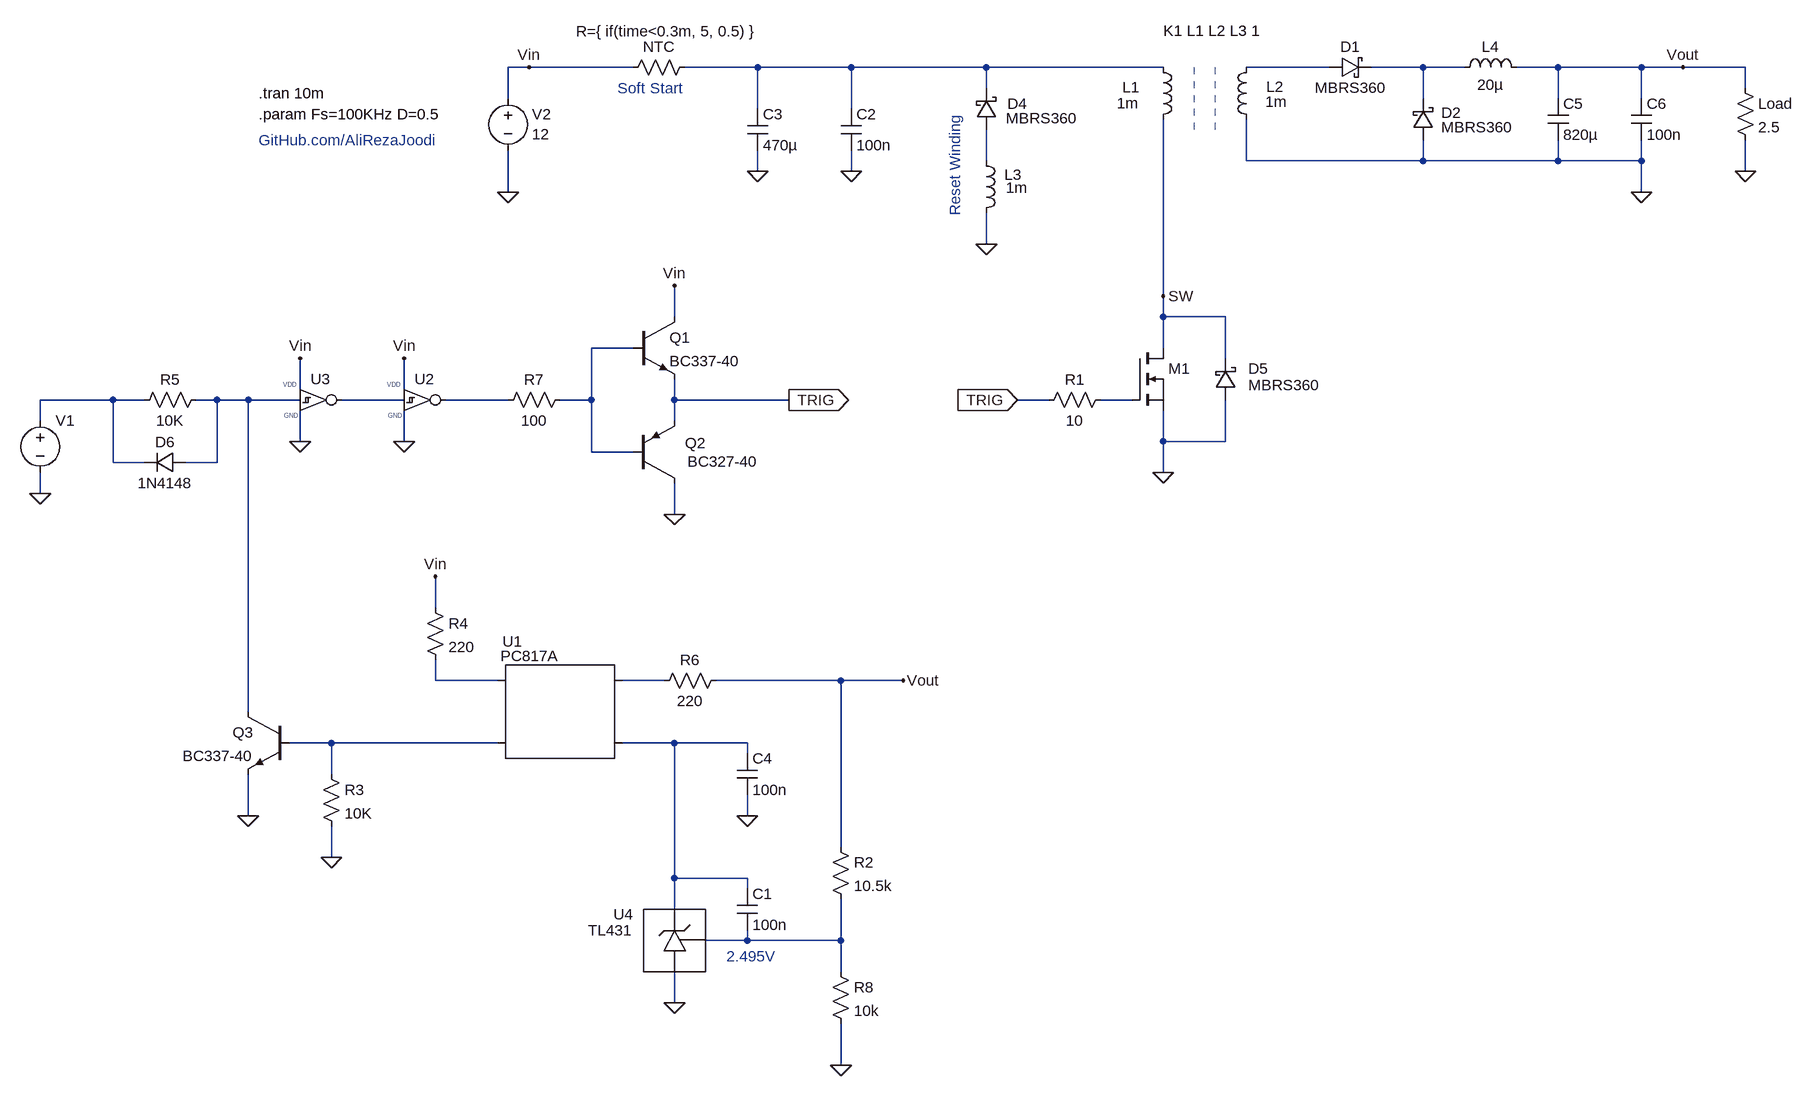
[diagram p0: schematic v2.0.asc]
v2.0.asc, the LTspice schematic file:
Version 4.1
SHEET 1 2268 1748
WIRE -144 96 -176 96
WIRE 16 96 -144 96
WIRE 208 96 96 96
WIRE 352 96 208 96
WIRE 560 96 352 96
WIRE 832 96 560 96
WIRE 1088 96 960 96
WIRE 1232 96 1152 96
WIRE 1296 96 1232 96
WIRE 1440 96 1376 96
WIRE 1568 96 1440 96
WIRE 1632 96 1568 96
WIRE 1728 96 1632 96
WIRE 560 128 560 96
WIRE 1728 128 1728 96
WIRE -176 144 -176 96
WIRE 1232 144 1232 96
WIRE 1440 144 1440 96
WIRE 1568 144 1568 96
WIRE 208 160 208 96
WIRE 352 160 352 96
WIRE 560 240 560 192
WIRE 960 240 960 176
WIRE 1232 240 1232 208
WIRE 1232 240 960 240
WIRE 1440 240 1440 208
WIRE 1440 240 1232 240
WIRE 1568 240 1568 208
WIRE 1568 240 1440 240
WIRE 208 256 208 224
WIRE 352 256 352 224
WIRE 1728 256 1728 208
WIRE -176 288 -176 224
WIRE 1568 288 1568 240
WIRE 560 368 560 320
WIRE 832 448 832 176
WIRE 80 480 80 432
WIRE 832 480 832 448
WIRE 928 480 832 480
WIRE 16 528 -48 528
WIRE 832 528 832 480
WIRE 928 544 928 480
WIRE -496 592 -496 544
WIRE -336 592 -336 544
WIRE -784 608 -896 608
WIRE -736 608 -784 608
WIRE -624 608 -656 608
WIRE -576 608 -624 608
WIRE -496 608 -576 608
WIRE -336 608 -432 608
WIRE -176 608 -272 608
WIRE -48 608 -48 528
WIRE -48 608 -96 608
WIRE 80 608 80 576
WIRE 256 608 80 608
WIRE 656 608 608 608
WIRE 784 608 736 608
WIRE -896 640 -896 608
WIRE 80 640 80 608
WIRE -496 672 -496 624
WIRE -336 672 -336 624
WIRE 832 672 832 624
WIRE 928 672 928 608
WIRE 928 672 832 672
WIRE -48 688 -48 608
WIRE 16 688 -48 688
WIRE -784 704 -784 608
WIRE -736 704 -784 704
WIRE -624 704 -624 608
WIRE -624 704 -672 704
WIRE 832 720 832 672
WIRE -896 752 -896 720
WIRE 80 784 80 736
WIRE -288 928 -288 880
WIRE -288 1040 -288 1008
WIRE -192 1040 -288 1040
WIRE 64 1040 0 1040
WIRE 336 1040 144 1040
WIRE 432 1040 336 1040
WIRE -576 1088 -576 608
WIRE -448 1136 -512 1136
WIRE -192 1136 -448 1136
WIRE 80 1136 0 1136
WIRE 192 1136 80 1136
WIRE 192 1152 192 1136
WIRE -448 1184 -448 1136
WIRE -576 1248 -576 1184
WIRE 192 1248 192 1216
WIRE 336 1296 336 1040
WIRE -448 1312 -448 1264
WIRE 80 1344 80 1136
WIRE 192 1344 80 1344
WIRE 192 1360 192 1344
WIRE 80 1392 80 1344
WIRE 192 1440 192 1424
WIRE 192 1440 128 1440
WIRE 336 1440 336 1376
WIRE 336 1440 192 1440
WIRE 336 1488 336 1440
WIRE 80 1536 80 1488
WIRE 336 1632 336 1568
FLAG -896 752 0
FLAG -176 288 0
FLAG 832 720 0
FLAG 352 256 0
FLAG 208 256 0
FLAG -144 96 Vin
FLAG 1568 288 0
FLAG 80 432 Vin
FLAG 80 784 0
FLAG 832 448 SW
FLAG 560 368 0
FLAG 1728 256 0
FLAG -576 1248 0
FLAG -448 1312 0
FLAG -288 880 Vin
FLAG -336 544 Vin
FLAG -336 672 0
FLAG -496 544 Vin
FLAG -496 672 0
FLAG 80 1536 0
FLAG 1632 96 Vout
FLAG 336 1632 0
FLAG 432 1040 Vout
FLAG 608 608 TRIG
IOPIN 608 608 In
FLAG 256 608 TRIG
IOPIN 256 608 Out
FLAG 192 1248 0
SYMBOL voltage -896 624 R0
WINDOW 3 24 96 Invisible 2
WINDOW 123 0 0 Left 0
WINDOW 39 39 69 Left 2
SYMATTR Value PULSE(0 12 0 {0.01/Fs} {0.01/Fs} {D/Fs} {1/Fs})
SYMATTR InstName V1
SYMBOL res 640 624 R270
WINDOW 0 32 56 VTop 2
WINDOW 3 0 56 VBottom 2
SYMATTR InstName R1
SYMATTR Value 10
SYMBOL ind 816 80 R0
WINDOW 0 -47 47 Left 2
WINDOW 3 -55 71 Left 2
SYMATTR InstName L1
SYMATTR Value 1m
SYMATTR Type ind
SYMBOL voltage -176 128 R0
WINDOW 0 37 40 Left 2
WINDOW 3 37 71 Left 2
WINDOW 123 0 0 Left 0
WINDOW 39 0 0 Left 0
SYMATTR InstName V2
SYMATTR Value 12
SYMBOL cap 336 160 R0
SYMATTR InstName C2
SYMATTR Value 100n
SYMBOL cap 192 160 R0
SYMATTR InstName C3
SYMATTR Value 470µ
SYMBOL ind 976 80 M0
WINDOW 0 -42 46 Left 2
WINDOW 3 -47 69 Left 2
SYMATTR InstName L2
SYMATTR Value 1m
SYMATTR Type ind
SYMBOL cap 1424 144 R0
SYMATTR InstName C5
SYMATTR Value 820µ
SYMBOL cap 1552 144 R0
SYMATTR InstName C6
SYMATTR Value 100n
SYMBOL res 1712 112 R0
SYMATTR InstName Load
SYMATTR Value 2.5
SYMBOL ind 1280 112 R270
WINDOW 0 32 56 VTop 2
WINDOW 3 5 56 VBottom 2
SYMATTR InstName L4
SYMATTR Value 20µ
SYMBOL nmos 784 528 R0
WINDOW 3 56 72 Invisible 2
SYMATTR Value BSC100N06LS3
SYMATTR InstName M1
SYMBOL npn 16 480 R0
SYMATTR InstName Q1
SYMATTR Value BC337-40
SYMBOL pnp 16 736 M180
WINDOW 0 80 62 Left 2
WINDOW 3 84 33 Left 2
SYMATTR InstName Q2
SYMATTR Value BC327-40
SYMBOL res -752 624 R270
WINDOW 0 32 56 VTop 2
WINDOW 3 0 56 VBottom 2
SYMATTR InstName R5
SYMATTR Value 10K
SYMBOL ind 544 336 M180
WINDOW 0 44 75 Left 2
WINDOW 3 46 55 Left 2
SYMATTR InstName L3
SYMATTR Value 1m
SYMATTR Type ind
SYMBOL schottky 1088 112 R270
WINDOW 0 32 32 VTop 2
WINDOW 3 0 32 VBottom 2
SYMATTR InstName D1
SYMATTR Value MBRS360
SYMBOL schottky 1216 208 M180
WINDOW 0 44 42 Left 2
WINDOW 3 44 20 Left 2
SYMATTR InstName D2
SYMATTR Value MBRS360
SYMBOL schottky 544 192 M180
WINDOW 0 48 40 Left 2
WINDOW 3 46 18 Left 2
SYMATTR InstName D4
SYMATTR Value MBRS360
SYMBOL schottky 912 608 M180
WINDOW 0 51 48 Left 2
WINDOW 3 51 23 Left 2
SYMATTR InstName D5
SYMATTR Value MBRS360
SYMBOL npn -512 1088 M0
SYMATTR InstName Q3
SYMATTR Value BC337-40
SYMBOL res -464 1168 R0
SYMATTR InstName R3
SYMATTR Value 10K
SYMBOL res -304 912 R0
SYMATTR InstName R4
SYMATTR Value 220
SYMBOL Optos\\PC817A -96 1088 M0
WINDOW 0 73 -108 Center 2
WINDOW 3 47 -86 Center 2
SYMATTR InstName U1
SYMBOL res 160 1024 R90
WINDOW 0 0 56 VBottom 2
WINDOW 3 32 56 VTop 2
SYMATTR InstName R6
SYMATTR Value 220
SYMBOL res -80 592 R90
WINDOW 0 0 56 VBottom 2
WINDOW 3 32 56 VTop 2
SYMATTR InstName R7
SYMATTR Value 100
SYMBOL MyLib\\Digital\\CD40106B -336 576 R0
WINDOW 38 16 64 Invisible 2
SYMATTR InstName U2
SYMATTR SpiceLine vdd=12
SYMBOL MyLib\\Digital\\CD40106B -496 576 R0
WINDOW 38 16 64 Invisible 2
SYMATTR InstName U3
SYMBOL diode -672 688 R90
WINDOW 0 0 32 VBottom 2
WINDOW 3 32 32 VTop 2
SYMATTR InstName D6
SYMATTR Value 1N4148
SYMBOL MyLib\\Regulator_Linear\\TL431 80 1440 M0
SYMATTR InstName U4
SYMBOL res 320 1280 R0
SYMATTR InstName R2
SYMATTR Value 10.5k
SYMBOL res 320 1472 R0
SYMATTR InstName R8
SYMATTR Value 10k
SYMBOL res 0 112 R270
WINDOW 0 32 56 VTop 2
WINDOW 3 87 68 VBottom 2
SYMATTR InstName NTC
SYMATTR Value R={ if(time<0.3m, 5, 0.5) }
SYMBOL cap 176 1360 R0
SYMATTR InstName C1
SYMATTR Value 100n
SYMBOL cap 176 1152 R0
SYMATTR InstName C4
SYMATTR Value 100n
TEXT -560 168 Left 2 !.param Fs=100KHz D=0.5
TEXT -560 136 Left 2 !.tran 10m
TEXT 832 40 Left 2 !K1 L1 L2 L3 1
TEXT 512 168 VRight 2 ;Reset Winding
TEXT -560 208 Left 2 ;GitHub.com/AliRezaJoodi
TEXT -8 128 Left 2 ;Soft Start
TEXT 160 1464 Left 2 ;2.495V
LINE Normal 880 192 880 96 2
LINE Normal 912 192 912 96 2

The netlist it stands for:
* v2.0.asc
V1 N006 0 PULSE(0 12 0 {0.01/Fs} {0.01/Fs} {D/Fs} {1/Fs})
R1 TRIG N010 10
L1 N001 SW 1m
V2 Vin 0 12
C2 N001 0 100n
C3 N001 0 470µ
L2 N002 0 1m
C5 Vout 0 820µ
C6 Vout 0 100n
R§Load Vout 0 2.5
L4 N003 Vout 20µ
M1 SW N010 0 0 BSC100N06LS3
Q1 Vin N005 TRIG 0 BC337-40
Q2 0 N005 TRIG 0 BC327-40
R5 N006 N007 10K
L3 0 N004 1m
D1 N002 N003 MBRS360
D2 0 N003 MBRS360
D4 N004 N001 MBRS360
D5 0 SW MBRS360
Q3 N007 N013 0 0 BC337-40
R3 N013 0 10K
R4 Vin N011 220
X§U1 N012 N014 N011 N013 PC817 Igain=1m
R6 Vout N012 220
R7 N005 N009 100
X§U2 N008 N009 Vin 0 CD40106B vdd=12 speed=2 tripdt=100n  ; pins in out VDD GND
X§U3 N007 N008 Vin 0 CD40106B vdd=5 speed=2 tripdt=100n  ; pins in out VDD GND
D6 N007 N006 1N4148
X§U4 N014 0 N015 TL431  ; pins CATHODE ANODE REF
R2 Vout N015 10.5k
R8 N015 0 10k
R§NTC Vin N001 R={ if(time<0.3m, 5, 0.5) }
C1 N014 N015 100n
C4 N014 0 100n
.model D D
.lib standard.dio
.model NPN NPN
.model PNP PNP
.lib standard.bjt
.model NMOS NMOS
.model PMOS PMOS
.lib standard.mos
.param Fs=100KHz D=0.5
.tran 10m
K1 L1 L2 L3 1
* Reset Winding
* GitHub.com/AliRezaJoodi
* Soft Start
* 2.495V
.lib PC817.sub
.lib MyLib/Digital/_CD4xxx.lib
.lib MyLib/Regulator_Linear/TL431.lib
.backanno
.end